# EAGLE design ArduinoSmarticleNoAccel (EAGLE 7.2.0)
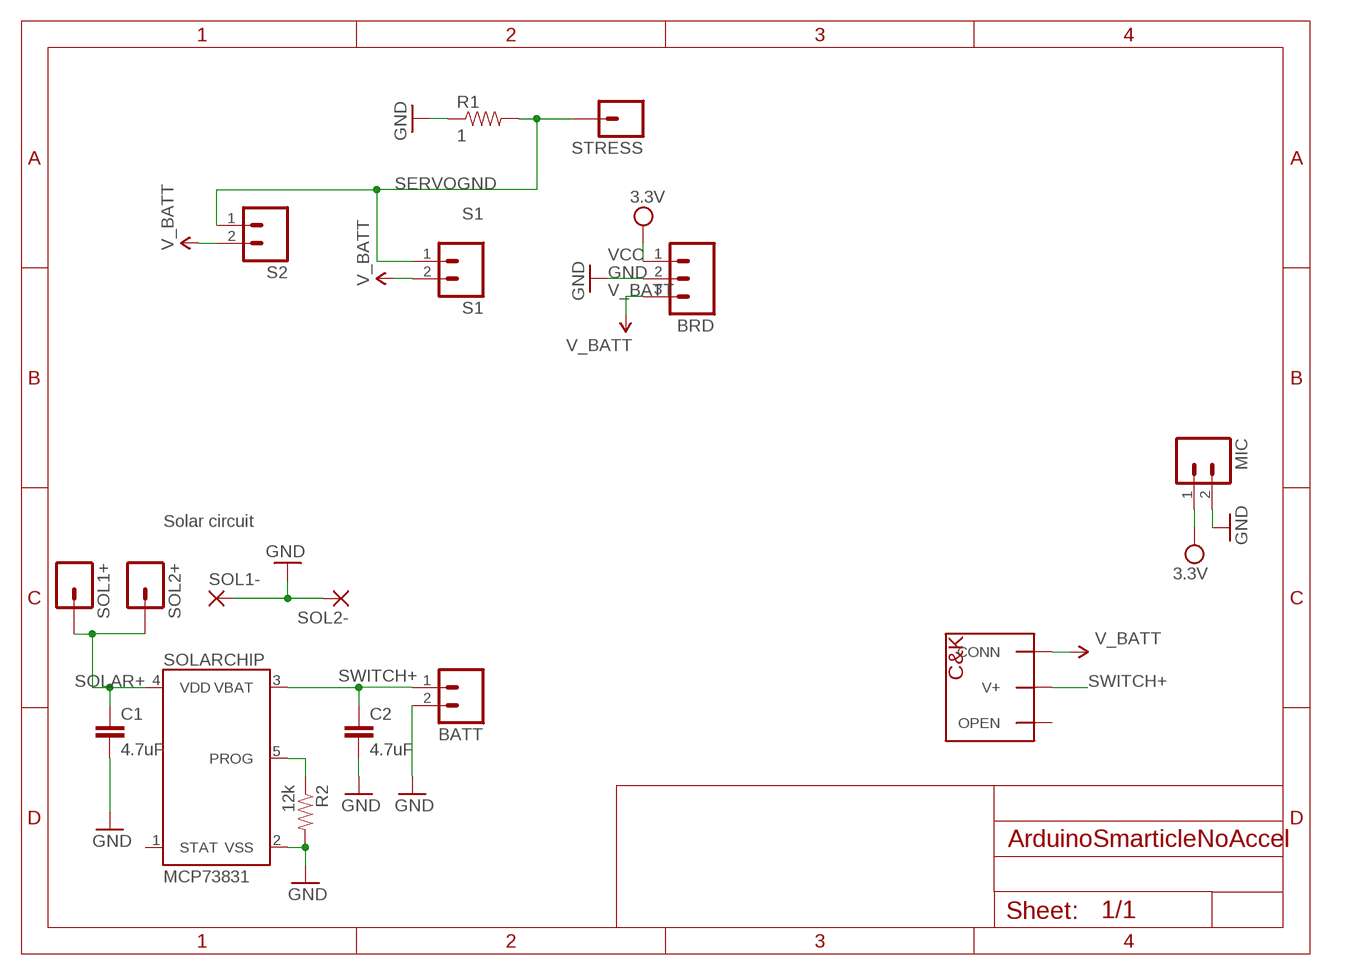
[diagram p0: schematic, sheet 1]

## Parts
BATT  M02PTH  [1X02]
BRD  M03PTH  [1X03]
C1  4.7uF  4.7UF-6.3V-10%(0603)0603  [0603-CAP]
C2  4.7uF  4.7UF-6.3V-10%(0603)0603  [0603-CAP]
MIC  M02PTH  [1X02]
R1  1  2.0KOHM1/10W5%(0603)  [0603-RES]
R2  12k  10.5KOHM1/10W1%(0603)  [0603]
S1  S1  M02PTH  [1X02]
S2  M02PTH  [1X02]
SOL1+  M01PTH  [1X01]
SOL1-  1,6/0,9  [1,6/0,9]
SOL2+  M01PTH  [1X01]
SOL2-  1,6/0,9  [1,6/0,9]
SOLARCHIP  MCP73831  [SOT23-5]
STRESS  M01PTH  [1X01]
U$1  WILL-BLACKSLIDESWITCH  [WILL-BLACKSLIDESWITCH]

## Nets
GND: BATT.2 BRD.2 C1.2 C2.2 MIC.2 R1.1 R2.2 SOL1-.1(P) SOL2-.1(P) SOLARCHIP.2(VSS)
N$5: R2.1 SOLARCHIP.5(PROG)
SERVOGND: R1.2 S1.1 S2.1 STRESS.1
SOLAR+: C1.1 SOL1+.1 SOL2+.1 SOLARCHIP.4(VDD)
SWITCH+: BATT.1 C2.1 SOLARCHIP.3(VBAT) U$1.V+
V_BATT: BRD.3 S1.2 S2.2 U$1.CONN
VCC: BRD.1 MIC.1 ; supply symbol labelled 3.3V
Unconnected: SOLARCHIP.1(STAT) U$1.NC(OPEN)

## Notes on the sheet
- Solar circuit

## Library data of the parts
BATT MIC S1 S2 = SparkFun-Connectors:M02: Standard 2-pin 0.1" header. Use with - straight break away headers ( PRT-00116) - right angle break away headers (PRT-00553) - swiss pins (PRT-00743) - machine pins (PRT-00117) - female headers (PRT-00115) Molex polarized connector foot print use with: PRT-08233 with associated crimp pins and housings. 2.54_SCREWTERM for use with PRT-10571. 3.5mm Screw Terminal footprints for PRT-08084 5mm Screw Terminal footprints for use with PRT-08432
BRD = SparkFun-Connectors:M03: Header 3 Standard 3-pin 0.1" header. Use with straight break away headers (SKU : PRT-00116), right angle break away headers (PRT-00553), swiss pins (PRT-00743), machine pins (PRT-00117), and female headers (PRT-00115). Molex polarized connector foot print use with SKU : PRT-08232 with associated crimp pins and housings.
C1 C2 = SparkFun-Capacitors:4.7UF-6.3V-10%(0603): CAP-08280; PROD_ID: CAP-08280
R1 = SparkFun-Resistors:2.0KOHM1/10W5%(0603): RES-08296; PROD_ID: RES-08296; VALUE: 2.0k
R2 = SparkFun-Resistors:10.5KOHM1/10W1%(0603): RES-09570; PROD_ID: RES-09570; VALUE: 10.5k
SOL1+ SOL2+ STRESS = SparkFun-Connectors:M01: Header 1 Standard 1-pin 0.1" header. Use with straight break away headers (SKU : PRT-00116), right angle break away headers (PRT-00553), swiss pins (PRT-00743), machine pins (PRT-00117), and female headers (PRT-00115). SMTSO-256-ET is a "flush mount" nut for a 4-40 screw. The older package used to be too tight, and did not allow it to sit properly thru the drill hit. The latest (0.165DIA) fits nice and snug.
SOL1- SOL2- = wirepad:1,6/0,9: THROUGH-HOLE PAD
SOLARCHIP = GeekAmmo:MCP73831: MCP73831 Miniature Single-Cell, Fully Integrated Li-Ion, Li-Polymer Charge Management Controllers The MCP73831/2 devices are highly advanced linear charge management controllers for use in spacelimited, cost-sensitive applications. http://ww1.microchip.com/downloads/en/DeviceDoc/20001984F.pdf
U$1 = Will-Switch:WILL-BLACKSLIDESWITCH

## Board
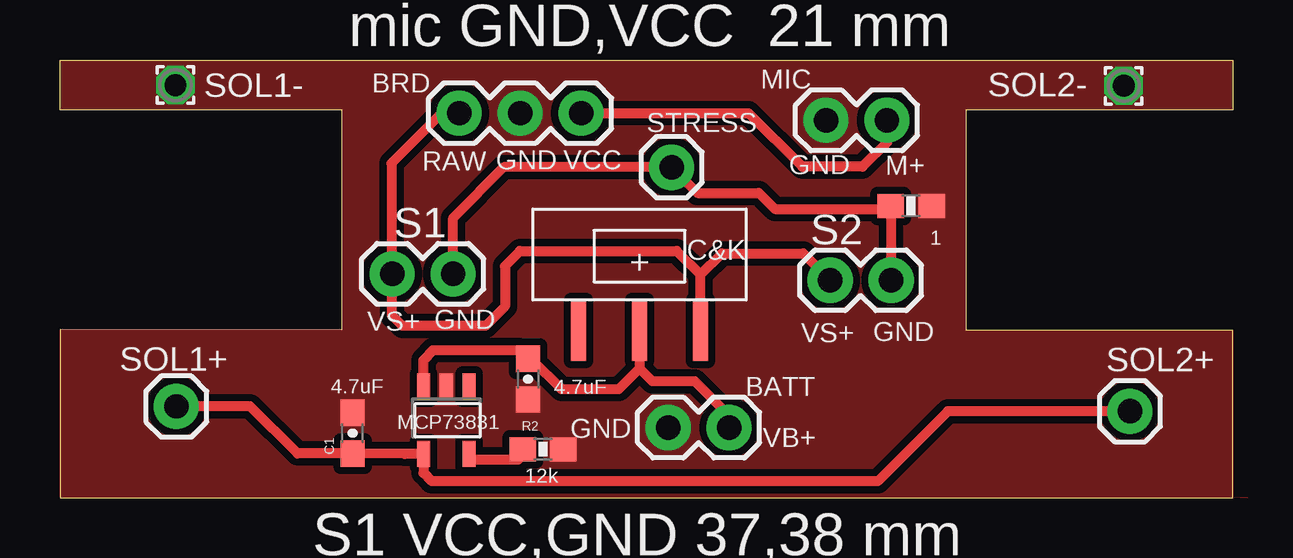
[diagram p1: board, top side]

Size 48.9 x 18.25 mm. Coordinates in mm from the lower left corner, seen from the top.
Outline: 0,7 0,0 48.9,0 48.9,7 37.75,7 37.75,16.15 48.9,16.15 48.9,18.25 0,18.25 0,16.15 11.75,16.15 11.75,7 0,7
Copper layers (1*16): Top 0.035mm / dielectric 1.5mm / Bottom 0.035mm
Design rules "SparkFun *": minimum track width 8mil, minimum drill 20mil, track to track 8mil, track to pad 8mil, pad to pad 8mil, via to via 8mil, smd to smd 8mil, copper to edge 0mil, drill to drill 8mil, minimum pad ring 12mil, minimum via ring 10mil, stop-mask expansion 4mil, vias tented up to drill 20mil, thermal gap 10mil

### Footprints (pad centres in the part's own frame; a part is rotated, then mirrored left to right if it is on the bottom)
1X02 = drill 1.016 pad 1.88: 1 0,0; 2 2.54,0
1X03 = drill 1.016 pad 1.88: 1 0,0; 2 2.54,0; 3 5.08,0
0603-CAP = smd 1.1 x 1: 1 -0.85,0; 2 0.85,0
0603-RES = smd 1.1 x 1: 1 -0.85,0; 2 0.85,0
0603 = smd 1.1 x 1: 1 -0.85,0; 2 0.85,0
1X01 = drill 1.016 pad 1.88: 1 0,0
1,6/0,9 = drill 0.914 pad 1.6 octagon: 1 0,0
SOT23-5 = smd 0.55 x 1.1: 1 -0.95,-1.3; 2 0,-1.3; 3 0.95,-1.3; 4 0.95,1.5; 5 -0.95,1.5
WILL-BLACKSLIDESWITCH = smd 2.54 x 0.635: CONN 5.08,6.985; NC 5.08,1.905; V+ 5.08,4.445

### Placement (x,y rotation side)
BATT  27.89,2.92 180 top
BRD  21.72,16.03 180 top
C1  12.19,2.69 90 top
C2  19.51,4.95 270 top
MIC  34.47,15.74 180 top
R1  35.48,12.17 180 top
R2  20.14,2.02 0 top
S1  16.39,9.33 180 top
S2  34.64,9.06 180 top
SOL1+  4.85,3.8 0 top
SOL1-  4.81,17.2 0 top
SOL2+  44.6,3.6 0 top
SOL2-  44.34,17.18 0 top
SOLARCHIP  16.1,3.32 180 top
STRESS  25.5,13.77 0 top
U$1  19.71,12.04 270 top

### Tracks (layer width: path | path; a pad name or v marks a point on that pad's centre or on a via)
GND
  pour Top (isolate 0.305, no thermals): 0,0 0,7 11.75,7 11.75,16.15 0,16.15 0,18.25 48.9,18.25 48.9,16.15 37.75,16.15 37.75,7 48.9,7 48.9,0.02 49.5,0
N$5
  Top 0.406: SOLARCHIP.5 17.14,1.59 19.11,1.59 R2.1 19.01,1.79
SERVOGND
  Top 0.406: 34.67,9.09 S2.1 R1.2 34.5,12.04 29.79,12.04 29.13,12.7 26.57,12.7 STRESS.1 18.5,13.77 16.39,11.66 S1.1
SOLAR+
  Top 0.406: SOL2+.1 37,3.6 34.09,0.69 15.49,0.69 15.15,1.02 SOLARCHIP.4 14.37,1.82 C1.1 9.9,1.84 7.92,3.81 SOL1+.1
SWITCH+
  Top 0.406: SOLARCHIP.3 15.15,5.73 15.54,6.15 19.16,6.15 C2.1 19.68,5.75 20.9,4.52 23.29,4.52 24.16,5.38 | U$1.V+ 24.16,5.38 | BATT.1 27.89,3.43 26.47,4.85 24.69,4.85 24.16,5.38
V_BATT
  Top 0.406: U$1.CONN 26.7,9.3 | 26.7,9.3 27.58,10.19 30.98,10.19 S2.2 | 26.7,9.3 25.7,10.29 19.18,10.29 18.54,9.65 18.54,7.98 17.73,7.16 14.28,7.16 13.84,7.59 S1.2 13.82,9.36 13.82,13.95 15.9,16.03 BRD.3
VCC
  Top 0.406: BRD.1 28.7,16.03 30.94,13.79 33.45,13.79 34.47,14.81 MIC.1

### Text on the board
tPlace: RAW,GND,VCC 26 mm | battery 45 mm | stress 28 mm A7 | mic 16 mm A6 | mic GND,VCC 21 mm | RAW | GND | VCC | GND | M+ | + | VS+ | GND | GND | VS+ | GND | VB+ | S1 VCC,GND 37,38 mm | S2 VCC,GND 37,38 mm | S1 SIG,48 mm D5 | S1 SIG,52 mm D6